# Altium schematic sheet 微机 (2).SchDoc
size A0
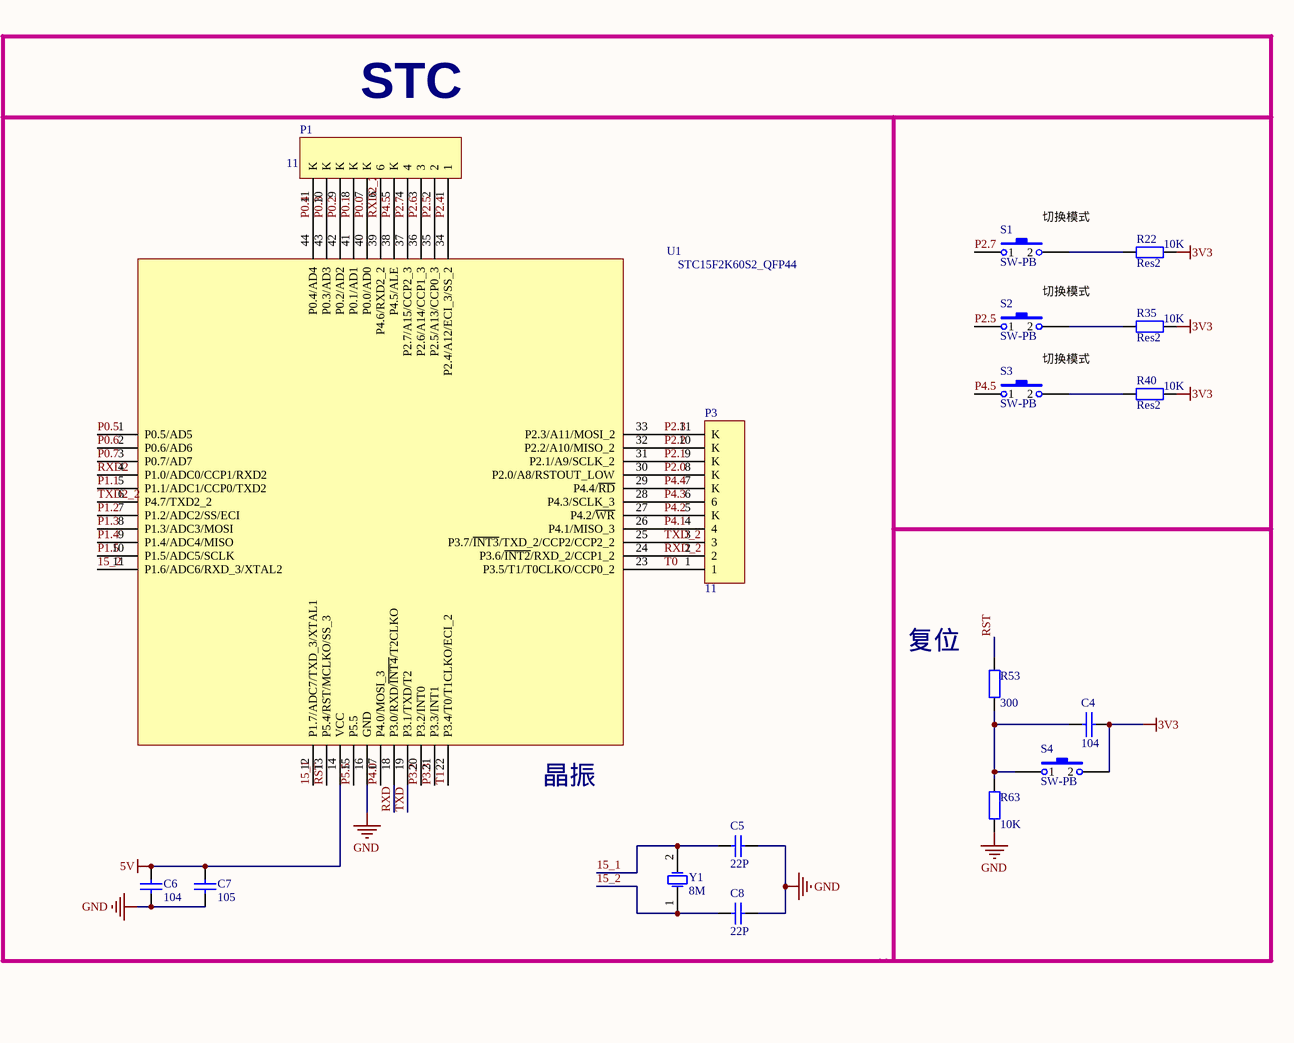
[diagram p0: 微机 (2).SchDoc, top left]
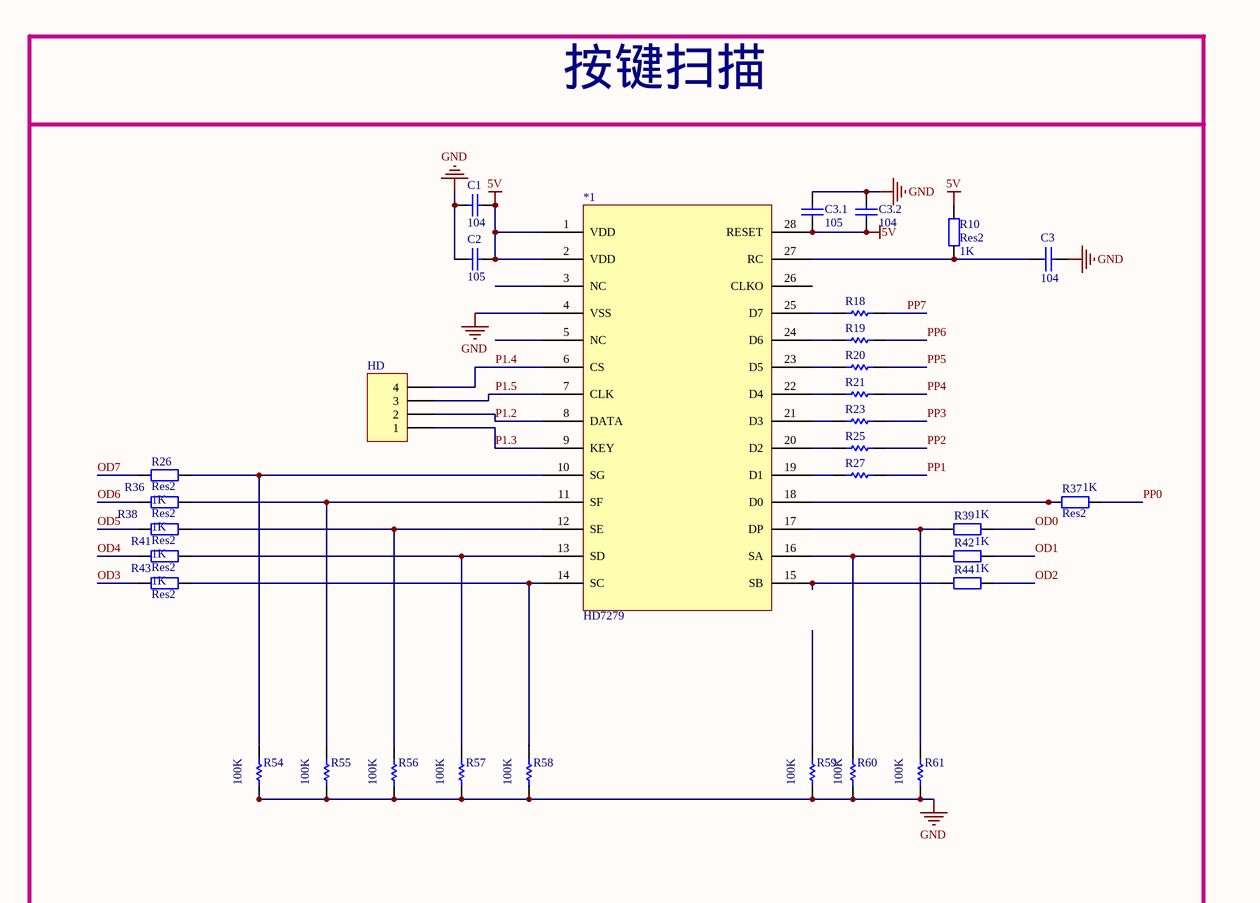
[diagram p1: 微机 (2).SchDoc, top middle]
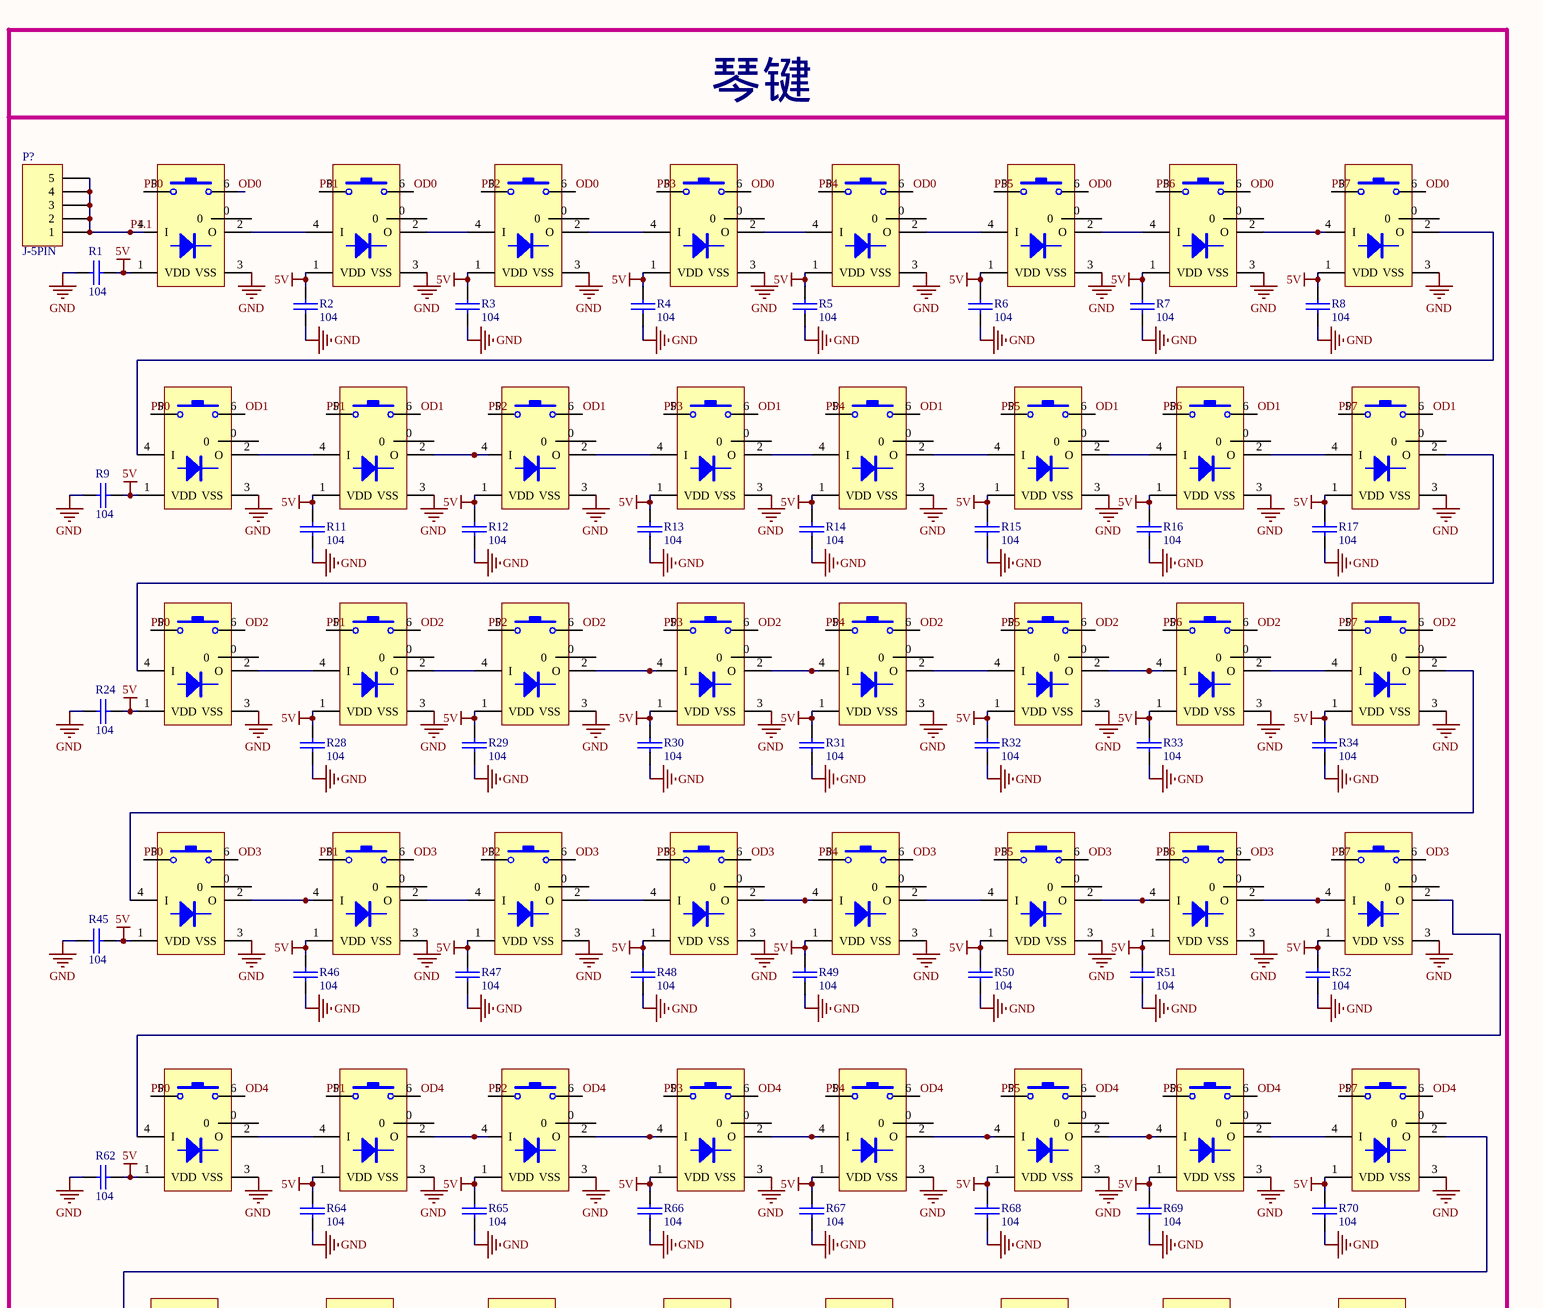
[diagram p2: 微机 (2).SchDoc, top right]
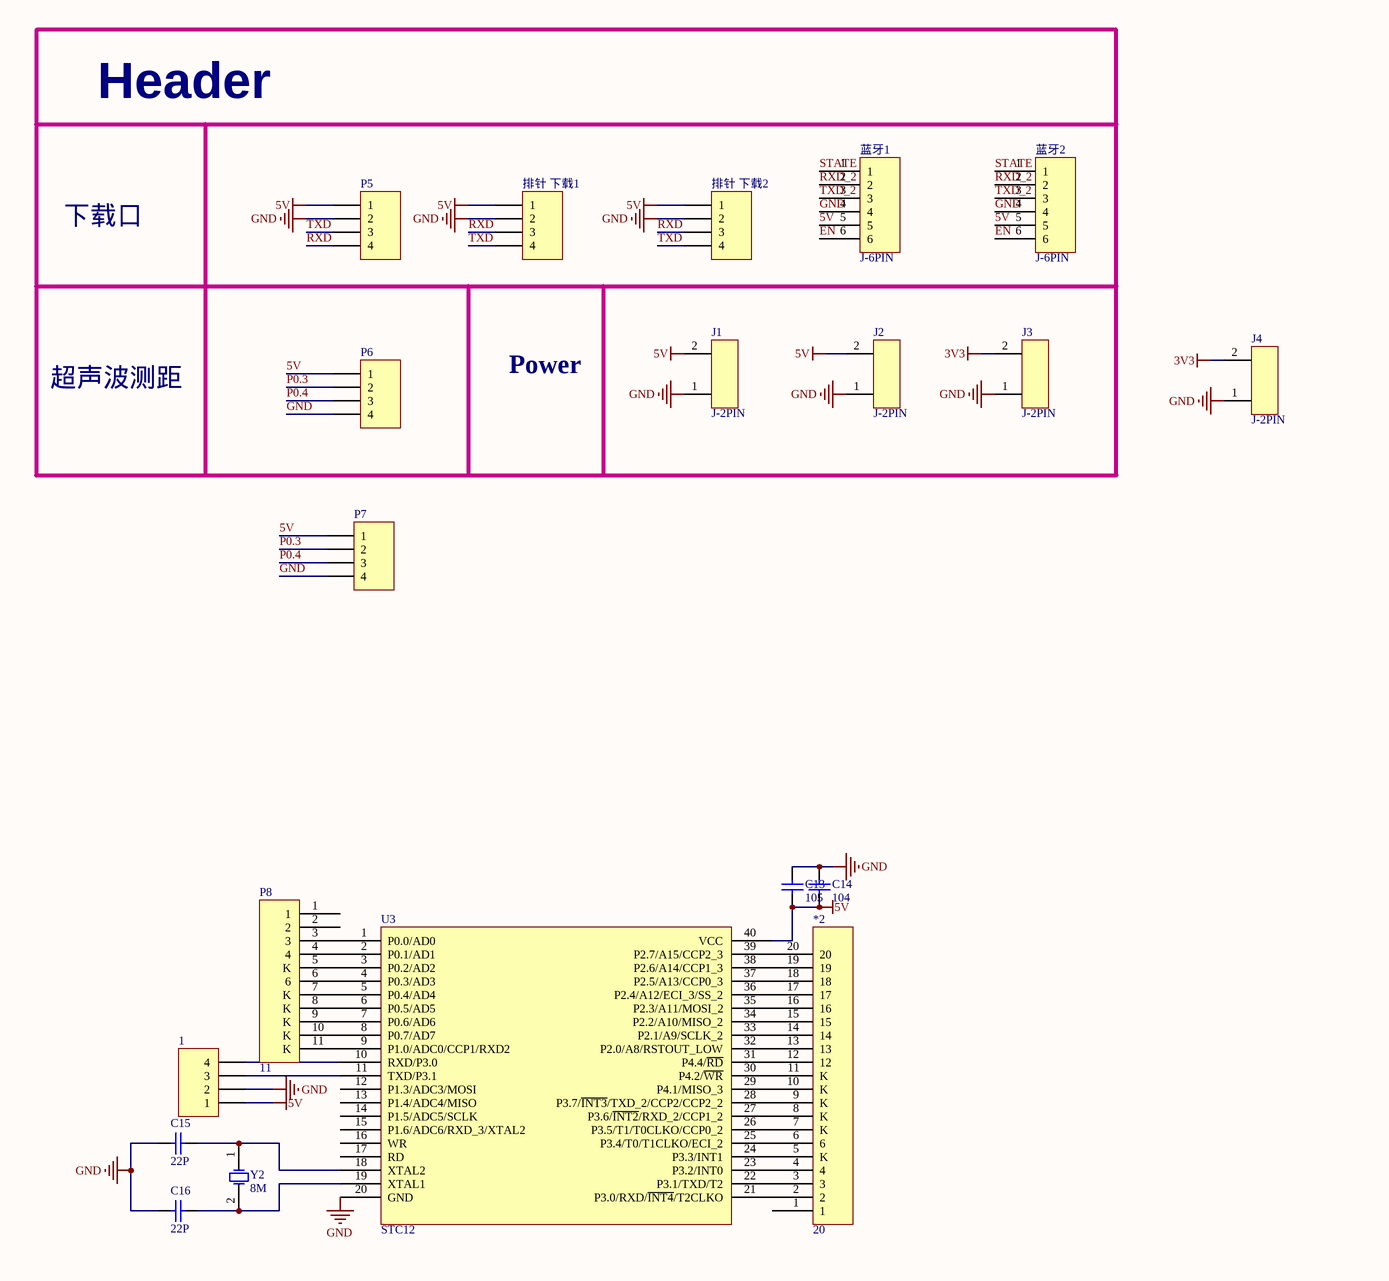
[diagram p3: 微机 (2).SchDoc, bottom left]
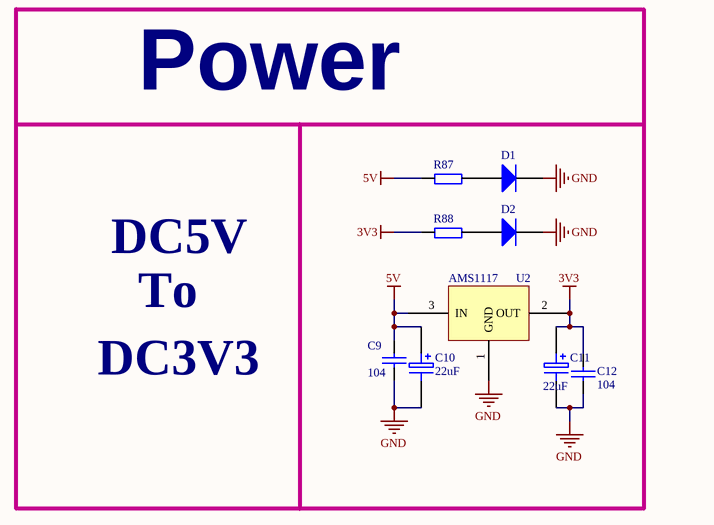
[diagram p4: 微机 (2).SchDoc, bottom middle]
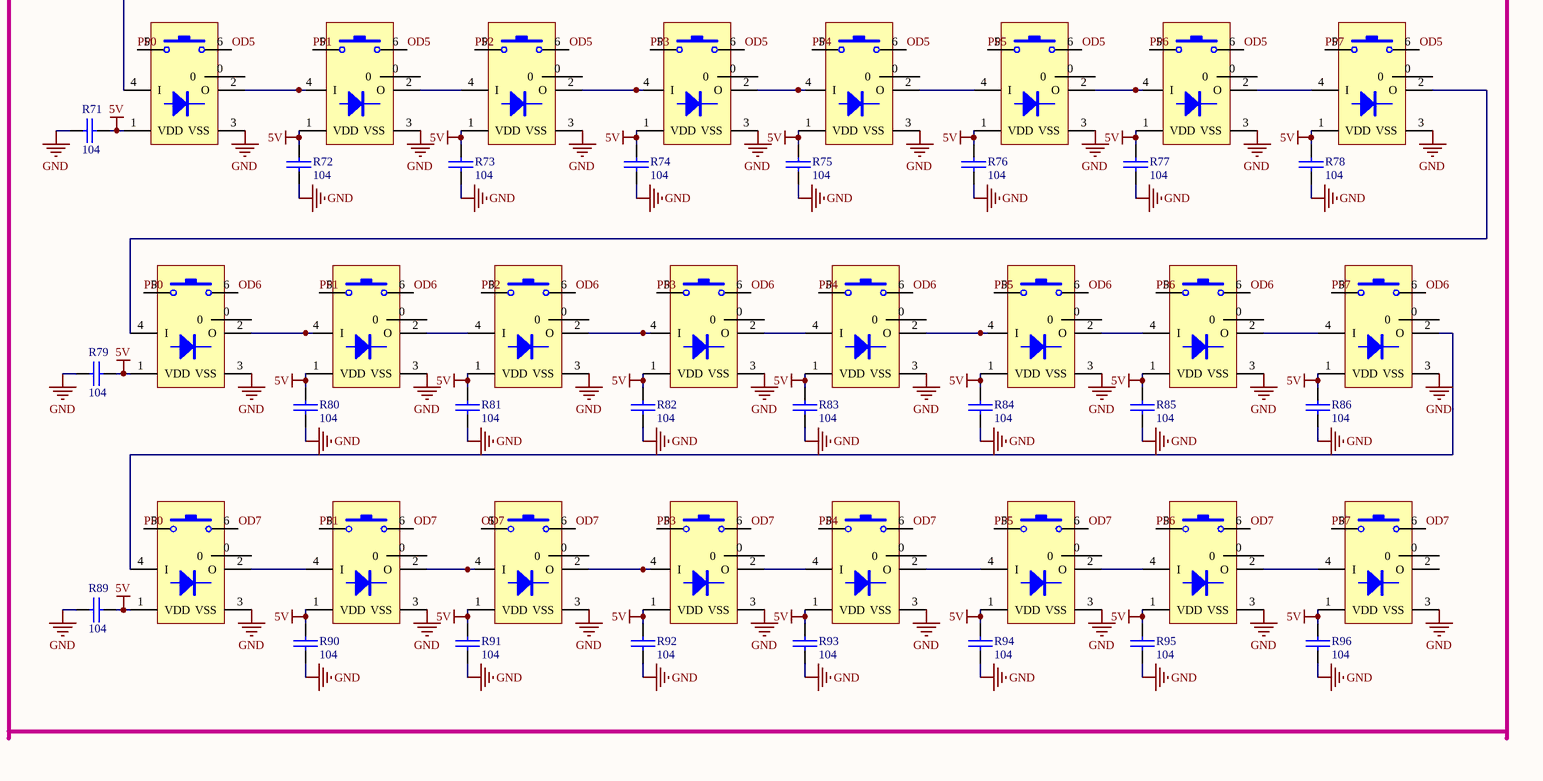
[diagram p5: 微机 (2).SchDoc, bottom right]

## Parts
1  (no value)  [HDR1X4]
*1  HD7279  [sol-28]
*2  20  [HDR1X20]
A1  RGB Light  [按键]  (value not drawn)
A2  RGB Light  [按键]  (value not drawn)
A3  RGB Light  [按键]  (value not drawn)
A4  RGB Light  [按键]  (value not drawn)
A5  RGB Light  [按键]  (value not drawn)
A6  RGB Light  [按键]  (value not drawn)
A7  RGB Light  [按键]  (value not drawn)
A8  RGB Light  [按键]  (value not drawn)
A9  RGB Light  [按键]  (value not drawn)
A10  RGB Light  [按键]  (value not drawn)
A11  RGB Light  [按键]  (value not drawn)
A12  RGB Light  [按键]  (value not drawn)
A13  RGB Light  [按键]  (value not drawn)
A14  RGB Light  [按键]  (value not drawn)
A15  RGB Light  [按键]  (value not drawn)
A16  RGB Light  [按键]  (value not drawn)
A17  RGB Light  [按键]  (value not drawn)
A18  RGB Light  [按键]  (value not drawn)
A19  RGB Light  [按键]  (value not drawn)
A20  RGB Light  [按键]  (value not drawn)
A21  RGB Light  [按键]  (value not drawn)
A22  RGB Light  [按键]  (value not drawn)
A23  RGB Light  [按键]  (value not drawn)
A24  RGB Light  [按键]  (value not drawn)
A25  RGB Light  [按键]  (value not drawn)
A26  RGB Light  [按键]  (value not drawn)
A27  RGB Light  [按键]  (value not drawn)
A28  RGB Light  [按键]  (value not drawn)
A29  RGB Light  [按键]  (value not drawn)
A30  RGB Light  [按键]  (value not drawn)
A31  RGB Light  [按键]  (value not drawn)
A32  RGB Light  [按键]  (value not drawn)
A33  RGB Light  [按键]  (value not drawn)
A34  RGB Light  [按键]  (value not drawn)
A35  RGB Light  [按键]  (value not drawn)
A36  RGB Light  [按键]  (value not drawn)
A37  RGB Light  [按键]  (value not drawn)
A38  RGB Light  [按键]  (value not drawn)
A39  RGB Light  [按键]  (value not drawn)
A40  RGB Light  [按键]  (value not drawn)
A41  RGB Light  [按键]  (value not drawn)
A42  RGB Light  [按键]  (value not drawn)
A43  RGB Light  [按键]  (value not drawn)
A44  RGB Light  [按键]  (value not drawn)
A45  RGB Light  [按键]  (value not drawn)
A46  RGB Light  [按键]  (value not drawn)
A47  RGB Light  [按键]  (value not drawn)
A48  RGB Light  [按键]  (value not drawn)
A49  RGB Light  [按键]  (value not drawn)
A50  RGB Light  [按键]  (value not drawn)
A51  RGB Light  [按键]  (value not drawn)
A52  RGB Light  [按键]  (value not drawn)
A53  RGB Light  [按键]  (value not drawn)
A54  RGB Light  [按键]  (value not drawn)
A55  RGB Light  [按键]  (value not drawn)
A56  RGB Light  [按键]  (value not drawn)
A57  RGB Light  [按键]  (value not drawn)
A58  RGB Light  [按键]  (value not drawn)
A59  RGB Light  [按键]  (value not drawn)
A60  RGB Light  [按键]  (value not drawn)
A61  RGB Light  [按键]  (value not drawn)
A62  RGB Light  [按键]  (value not drawn)
A63  RGB Light  [按键]  (value not drawn)
C1  104  [C-0603C]
C2  105  [C-0603C]
C3  104  [C-0603C]
C3.1  105  [C-0603C]
C3.2  104  [C-0603C]
C4  104  [C-0603C]
C5  22P  [C-0603C]
C6  104  [C-0603C]
C7  105  [C-0603C]
C8  22P  [C-0603C]
C9  104  [C-0603C]
C10  22uF  [CAP-8x12-3.5]
C11  22uF  [CAP-8x12-3.5]
C12  104  [C-0603C]
C13  105  [C-0603C]
C14  104  [C-0603C]
C15  22P  [C-0603C]
C16  22P  [C-0603C]
D1  (no value)  [D-0603D]
D2  (no value)  [D-0603D]
HD  (no value)  [HDR1X4]
J1  J-2PIN  [J-2-2.54-xh]
J2  J-2PIN  [J-2-2.54-xh]
J3  J-2PIN  [J-2-3.81-VH]
J4  J-2PIN  [J-2-3.81-VH]
P1  11  [HDR1X11]
P3  11  [HDR1X11]
P5  (no value)  [USB-Z]
P6  (no value)  [HDR1X4H]
P7  (no value)  [HDR1X4]
P8  11  [HDR1X11]
P?  J-5PIN  [HDR1X5]
R1  104  [C-0603C]
R2  104  [C-0603C]
R3  104  [C-0603C]
R4  104  [C-0603C]
R5  104  [C-0603C]
R6  104  [C-0603C]
R7  104  [C-0603C]
R8  104  [C-0603C]
R9  104  [C-0603C]
R10  Res2  value 1K  [R-0603R]
R11  104  [C-0603C]
R12  104  [C-0603C]
R13  104  [C-0603C]
R14  104  [C-0603C]
R15  104  [C-0603C]
R16  104  [C-0603C]
R17  104  [C-0603C]
R18  (no value)  [R-0603R]
R19  (no value)  [R-0603R]
R20  (no value)  [R-0603R]
R21  (no value)  [R-0603R]
R22  Res2  value 10K  [R-0603R]
R23  (no value)  [R-0603R]
R24  104  [C-0603C]
R25  (no value)  [R-0603R]
R26  Res2  value 1K  [R-0603R]
R27  (no value)  [R-0603R]
R28  104  [C-0603C]
R29  104  [C-0603C]
R30  104  [C-0603C]
R31  104  [C-0603C]
R32  104  [C-0603C]
R33  104  [C-0603C]
R34  104  [C-0603C]
R35  Res2  value 10K  [R-0603R]
R36  Res2  value 1K  [R-0603R]
R37  Res2  value 1K  [R-0603R]
R38  Res2  value 1K  [R-0603R]
R39  value 1K  [R-0603R]  (hidden comment: Res2)
R40  Res2  value 10K  [R-0603R]
R41  Res2  value 1K  [R-0603R]
R42  value 1K  [R-0603R]  (hidden comment: Res2)
R43  Res2  [R-0603R]
R44  value 1K  [R-0603R]  (hidden comment: Res2)
R45  104  [C-0603C]
R46  104  [C-0603C]
R47  104  [C-0603C]
R48  104  [C-0603C]
R49  104  [C-0603C]
R50  104  [C-0603C]
R51  104  [C-0603C]
R52  104  [C-0603C]
R53  value 300  [R-0603R]  (hidden comment: Res2)
R54  100K  [R-0603R]
R55  100K  [R-0603R]
R56  100K  [R-0603R]
R57  100K  [R-0603R]
R58  100K  [R-0603R]
R59  100K  [R-0603R]
R60  100K  [R-0603R]
R61  100K  [R-0603R]
R62  104  [C-0603C]
R63  value 10K  [R-0603R]  (hidden comment: Res2)
R64  104  [C-0603C]
R65  104  [C-0603C]
R66  104  [C-0603C]
R67  104  [C-0603C]
R68  104  [C-0603C]
R69  104  [C-0603C]
R70  104  [C-0603C]
R71  104  [C-0603C]
R72  104  [C-0603C]
R73  104  [C-0603C]
R74  104  [C-0603C]
R75  104  [C-0603C]
R76  104  [C-0603C]
R77  104  [C-0603C]
R78  104  [C-0603C]
R79  104  [C-0603C]
R80  104  [C-0603C]
R81  104  [C-0603C]
R82  104  [C-0603C]
R83  104  [C-0603C]
R84  104  [C-0603C]
R85  104  [C-0603C]
R86  104  [C-0603C]
R87  10K  [R-0603R]  (value not drawn)
R88  10K  [R-0603R]  (value not drawn)
R89  104  [C-0603C]
R90  104  [C-0603C]
R91  104  [C-0603C]
R92  104  [C-0603C]
R93  104  [C-0603C]
R94  104  [C-0603C]
R95  104  [C-0603C]
R96  104  [C-0603C]
S1  SW-PB  [模式转换开关]
S2  SW-PB  [模式转换开关]
S3  SW-PB  [模式转换开关]
S4  SW-PB  [模式转换开关]
U1  STC15F2K60S2_QFP44  [LQFP44]
U2  AMS1117  [SOT-223]
U3  STC12  [DIP40]
Y1  8M  [X-HC49SM]
Y2  8M  [X-HC49SM]
按1  RGB Light  [按键]  (value not drawn)
排针_下载1  (no value)  [HDR1X4]
排针_下载2  (no value)  [HDR1X4]
蓝牙1  J-6PIN  [HDR1X6]
蓝牙2  J-6PIN  [HDR1X6H]

## Blocks framed on the sheet
按键扫描: *1 C1-C3 C3.1 C3.2 HD R10 R18-R21 R23 R25-R27 R36-R39 R41-R44 R54-R61
Power: C9-C12 D1 D2 R87 R88 U2

## Nets
3V3: C4.2 C11.1 C12.1 J3.2 J4.2 R22.2 R35.2 R40.2 R88.1 S4.2 U2.2(OUT)
5V: 1.1 *1.1(VDD) *1.2(VDD) *1.28(RESET) A1.1(VDD) A2.1(VDD) A3.1(VDD) A4.1(VDD) A5.1(VDD) A6.1(VDD) A7.1(VDD) A8.1(VDD) A9.1(VDD) A10.1(VDD) A11.1(VDD) A12.1(VDD) A13.1(VDD) A14.1(VDD) A15.1(VDD) A16.1(VDD) A17.1(VDD) A18.1(VDD) A19.1(VDD) A20.1(VDD) A21.1(VDD) A22.1(VDD) A23.1(VDD) A24.1(VDD) A25.1(VDD) A26.1(VDD) A27.1(VDD) A28.1(VDD) A29.1(VDD) A30.1(VDD) A31.1(VDD) A32.1(VDD) A33.1(VDD) A34.1(VDD) A35.1(VDD) A36.1(VDD) A37.1(VDD) A38.1(VDD) A39.1(VDD) A40.1(VDD) A41.1(VDD) A42.1(VDD) A43.1(VDD) A44.1(VDD) A45.1(VDD) A46.1(VDD) A47.1(VDD) A48.1(VDD) A49.1(VDD) A50.1(VDD) A51.1(VDD) A52.1(VDD) A53.1(VDD) A54.1(VDD) A55.1(VDD) A56.1(VDD) A57.1(VDD) A58.1(VDD) A59.1(VDD) A60.1(VDD) A61.1(VDD) A62.1(VDD) A63.1(VDD) C1.1 C2.1 C3.1.1 C3.2.1 C6.1 C7.1 C9.1 C10.1 C13.1 C14.1 J1.2 J2.2 P5.1 P6.1 P7.1 R1.2 R2.2 R3.2 R4.2 R5.2 R6.2 R7.2 R8.2 R9.2 R10.2 R11.2 R12.2 R13.2 R14.2 R15.2 R16.2 R17.2 R24.2 R28.2 R29.2 R30.2 R31.2 R32.2 R33.2 R34.2 R45.2 R46.2 R47.2 R48.2 R49.2 R50.2 R51.2 R52.2 R62.2 R64.2 R65.2 R66.2 R67.2 R68.2 R69.2 R70.2 R71.2 R72.2 R73.2 R74.2 R75.2 R76.2 R77.2 R78.2 R79.2 R80.2 R81.2 R82.2 R83.2 R84.2 R85.2 R86.2 R87.1 R89.2 R90.2 R91.2 R92.2 R93.2 R94.2 R95.2 R96.2 U1.14(VCC) U2.3(IN) U3.40(VCC) 按1.1(VDD) 排针_下载1.1 排针_下载2.1 蓝牙1.5 蓝牙2.5
GND: 1.2 *1.4(VSS) A1.3(VSS) A2.3(VSS) A3.3(VSS) A4.3(VSS) A5.3(VSS) A6.3(VSS) A7.3(VSS) A8.3(VSS) A9.3(VSS) A10.3(VSS) A11.3(VSS) A12.3(VSS) A13.3(VSS) A14.3(VSS) A15.3(VSS) A16.3(VSS) A17.3(VSS) A18.3(VSS) A19.3(VSS) A20.3(VSS) A21.3(VSS) A22.3(VSS) A23.3(VSS) A24.3(VSS) A25.3(VSS) A26.3(VSS) A27.3(VSS) A28.3(VSS) A29.3(VSS) A30.3(VSS) A31.3(VSS) A32.3(VSS) A33.3(VSS) A34.3(VSS) A35.3(VSS) A36.3(VSS) A37.3(VSS) A38.3(VSS) A39.3(VSS) A40.3(VSS) A41.3(VSS) A42.3(VSS) A43.3(VSS) A44.3(VSS) A45.3(VSS) A46.3(VSS) A47.3(VSS) A48.3(VSS) A49.3(VSS) A50.3(VSS) A51.3(VSS) A52.3(VSS) A53.3(VSS) A54.3(VSS) A55.3(VSS) A56.3(VSS) A57.3(VSS) A58.3(VSS) A59.3(VSS) A60.3(VSS) A61.3(VSS) A62.3(VSS) A63.3(VSS) C1.2 C2.2 C3.2 C3.1.2 C3.2.2 C5.2 C6.2 C7.2 C8.2 C9.2 C10.2 C11.2 C12.2 C13.2 C14.2 C15.2 C16.2 D1.2(K) D2.2(K) J1.1 J2.1 J3.1 J4.1 P5.2 P6.4 P7.4 R1.1 R2.1 R3.1 R4.1 R5.1 R6.1 R7.1 R8.1 R9.1 R11.1 R12.1 R13.1 R14.1 R15.1 R16.1 R17.1 R24.1 R28.1 R29.1 R30.1 R31.1 R32.1 R33.1 R34.1 R45.1 R46.1 R47.1 R48.1 R49.1 R50.1 R51.1 R52.1 R54.1 R55.1 R56.1 R57.1 R58.1 R59.1 R60.1 R61.1 R62.1 R63.1 R64.1 R65.1 R66.1 R67.1 R68.1 R69.1 R70.1 R71.1 R72.1 R73.1 R74.1 R75.1 R76.1 R77.1 R78.1 R79.1 R80.1 R81.1 R82.1 R83.1 R84.1 R85.1 R86.1 R89.1 R90.1 R91.1 R92.1 R93.1 R94.1 R95.1 R96.1 U1.16(GND) U2.1(GND) U3.20(GND) 按1.3(VSS) 排针_下载1.2 排针_下载2.2 蓝牙1.4 蓝牙2.4
15_1: C5.1 U1.12(P1.7/ADC7/TXD_3/XTAL1) Y1.2(OSC2)
15_2: C8.1 U1.11(P1.6/ADC6/RXD_3/XTAL2) Y1.1(OSC1)
EN: 蓝牙1.6 蓝牙2.6
OD0: A1.6 A2.6 A3.6 A4.6 A5.6 A6.6 A7.6 R39.1 按1.6
OD1: A8.6 A9.6 A10.6 A11.6 A12.6 A13.6 A14.6 A15.6 R42.1
OD2: A16.6 A17.6 A18.6 A19.6 A20.6 A21.6 A22.6 A23.6 R44.1
OD3: A24.6 A25.6 A26.6 A27.6 A28.6 A29.6 A30.6 A31.6 R43.1
OD4: A32.6 A33.6 A34.6 A35.6 A36.6 A37.6 A38.6 A39.6 R41.1
OD5: A40.6 A41.6 A42.6 A43.6 A44.6 A45.6 A46.6 A47.6 R38.1
OD6: A48.6 A49.6 A50.6 A51.6 A52.6 A53.6 A54.6 A55.6 R36.1
OD7: A56.6 A57.6 A58.5 A58.6 A59.6 A60.6 A61.6 A62.6 A63.6 R26.1
P0.0: P1.7(K) U1.40(P0.0/AD0)
P0.1: P1.8(K) U1.41(P0.1/AD1)
P0.2: P1.9(K) U1.42(P0.2/AD2)
P0.3: P1.10(K) P6.2 P7.2 U1.43(P0.3/AD3)
P0.4: P1.11(K) P6.3 P7.3 U1.44(P0.4/AD4)
P0.5: U1.1(P0.5/AD5)
P0.6: U1.2(P0.6/AD6)
P0.7: U1.3(P0.7/AD7)
P1.1: A1.4(I) P?.1 P?.2 P?.3 P?.4 P?.5 U1.5(P1.1/ADC1/CCP0/TXD2)
P1.2: *1.8(DATA) HD.2 U1.7(P1.2/ADC2/SS/ECI)
P1.3: *1.9(KEY) HD.1 U1.8(P1.3/ADC3/MOSI)
P1.4: *1.6(CS) HD.4 U1.9(P1.4/ADC4/MISO)
P1.5: *1.7(CLK) HD.3 U1.10(P1.5/ADC5/SCLK)
P2.0: P3.8(K) U1.30(P2.0/A8/RSTOUT_LOW)
P2.1: P3.9(K) U1.31(P2.1/A9/SCLK_2)
P2.2: P3.10(K) U1.32(P2.2/A10/MISO_2)
P2.3: P3.11(K) U1.33(P2.3/A11/MOSI_2)
P2.4: P1.1 U1.34(P2.4/A12/ECI_3/SS_2)
P2.5: P1.2 S2.1 U1.35(P2.5/A13/CCP0_3)
P2.6: P1.3 U1.36(P2.6/A14/CCP1_3)
P2.7: P1.4 S1.1 U1.37(P2.7/A15/CCP2_3)
P3.2: U1.20(P3.2/INT0)
P3.3: U1.21(P3.3/INT1)
P4.0: U1.17(P4.0/MOSI_3)
P4.1: P3.4 U1.26(P4.1/MISO_3)
P4.2: P3.5(K) U1.27(P4.2/~{WR})
P4.3: P3.6 U1.28(P4.3/SCLK_3)
P4.4: P3.7(K) U1.29(P4.4/~{RD})
P4.5: P1.5(K) S3.1 U1.38(P4.5/ALE)
P5.5: U1.15(P5.5)
PP0: A1.5 A8.5 A16.5 A24.5 A32.5 A40.5 A48.5 A56.5 R37.1
PP1: A2.5 A9.5 A17.5 A25.5 A33.5 A41.5 A49.5 A57.5 R27.1
PP2: A3.5 A10.5 A18.5 A26.5 A34.5 A42.5 A50.5 R25.1
PP3: A4.5 A11.5 A19.5 A27.5 A35.5 A43.5 A51.5 A59.5 R23.1
PP4: A5.5 A12.5 A20.5 A28.5 A36.5 A44.5 A52.5 A60.5 R21.1
PP5: A6.5 A13.5 A21.5 A29.5 A37.5 A45.5 A53.5 A61.5 R20.1
PP6: A7.5 A14.5 A22.5 A30.5 A38.5 A46.5 A54.5 A62.5 R19.1
PP7: A15.5 A23.5 A31.5 A39.5 A47.5 A55.5 A63.5 R18.1 按1.5
RST: R53.2 U1.13(P5.4/RST/MCLKO/SS_3)
RXD: P5.4 U1.18(P3.0/RXD/~{INT4}/T2CLKO) 排针_下载1.3 排针_下载2.3
RXD2: U1.4(P1.0/ADC0/CCP1/RXD2)
RXD2_2: P1.6 U1.39(P4.6/RXD2_2)
RXD_2: P3.2 U1.24(P3.6/~{INT2}/RXD_2/CCP1_2) 蓝牙1.2 蓝牙2.2
STATE: 蓝牙1.1 蓝牙2.1
T0: P3.1 U1.23(P3.5/T1/T0CLKO/CCP0_2)
T1: U1.22(P3.4/T0/T1CLKO/ECI_2)
TXD: P5.3 U1.19(P3.1/TXD/T2) 排针_下载1.4 排针_下载2.4
TXD2_2: U1.6(P4.7/TXD2_2)
TXD_2: P3.3 U1.25(P3.7/~{INT3}/TXD_2/CCP2/CCP2_2) 蓝牙1.3 蓝牙2.3
Net1_3: 1.3 U3.11(TXD/P3.1)
Net1_4: 1.4 U3.10(RXD/P3.0)
Net*1_10: *1.10(SG) R26.2 R54.2
Net*1_11: *1.11(SF) R36.2 R55.2
Net*1_12: *1.12(SE) R38.2 R56.2
Net*1_13: *1.13(SD) R41.2 R57.2
Net*1_14: *1.14(SC) R43.2 R58.2
Net*1_15: *1.15(SB) R44.2
Net*1_16: *1.16(SA) R42.2 R60.2
Net*1_17: *1.17(DP) R39.2 R61.2
Net*1_18: *1.18(D0) R37.2
Net*1_19: *1.19(D1) R27.2
Net*1_20: *1.20(D2) R25.2
Net*1_21: *1.21(D3) R23.2
Net*1_22: *1.22(D4) R21.2
Net*1_23: *1.23(D5) R20.2
Net*1_24: *1.24(D6) R19.2
Net*1_25: *1.25(D7) R18.2
Net*1_27: *1.27(RC) C3.1 R10.1
Net*2_2: *2.2 U3.21(P3.0/RXD/~{INT4}/T2CLKO)
Net*2_3: *2.3 U3.22(P3.1/TXD/T2)
Net*2_4: *2.4 U3.23(P3.2/INT0)
Net*2_5: *2.5(K) U3.24(P3.3/INT1)
Net*2_6: *2.6 U3.25(P3.4/T0/T1CLKO/ECI_2)
Net*2_7: *2.7(K) U3.26(P3.5/T1/T0CLKO/CCP0_2)
Net*2_8: *2.8(K) U3.27(P3.6/~{INT2}/RXD_2/CCP1_2)
Net*2_9: *2.9(K) U3.28(P3.7/~{INT3}/TXD_2/CCP2/CCP2_2)
Net*2_10: *2.10(K) U3.29(P4.1/MISO_3)
Net*2_11: *2.11(K) U3.30(P4.2/~{WR})
Net*2_12: *2.12 U3.31(P4.4/~{RD})
Net*2_13: *2.13 U3.32(P2.0/A8/RSTOUT_LOW)
Net*2_14: *2.14 U3.33(P2.1/A9/SCLK_2)
Net*2_15: *2.15 U3.34(P2.2/A10/MISO_2)
Net*2_16: *2.16 U3.35(P2.3/A11/MOSI_2)
Net*2_17: *2.17 U3.36(P2.4/A12/ECI_3/SS_2)
Net*2_18: *2.18 U3.37(P2.5/A13/CCP0_3)
Net*2_19: *2.19 U3.38(P2.6/A14/CCP1_3)
Net*2_20: *2.20 U3.39(P2.7/A15/CCP2_3)
NetA1_2: A1.2(O) A2.4(I)
NetA2_2: A2.2(O) A3.4(I)
NetA3_2: A3.2(O) A4.4(I)
NetA4_2: A4.2(O) A5.4(I)
NetA5_2: A5.2(O) A6.4(I)
NetA6_2: A6.2(O) A7.4(I)
NetA7_2: A7.2(O) 按1.4(I)
NetA8_2: A8.2(O) A9.4(I)
NetA8_4: A8.4(I) 按1.2(O)
NetA9_2: A9.2(O) A10.4(I)
NetA10_2: A10.2(O) A11.4(I)
NetA11_2: A11.2(O) A12.4(I)
NetA12_2: A12.2(O) A13.4(I)
NetA13_2: A13.2(O) A14.4(I)
NetA14_2: A14.2(O) A15.4(I)
NetA15_2: A15.2(O) A16.4(I)
NetA16_2: A16.2(O) A17.4(I)
NetA17_2: A17.2(O) A18.4(I)
NetA18_2: A18.2(O) A19.4(I)
NetA19_2: A19.2(O) A20.4(I)
NetA20_2: A20.2(O) A21.4(I)
NetA21_2: A21.2(O) A22.4(I)
NetA22_2: A22.2(O) A23.4(I)
NetA23_2: A23.2(O) A24.4(I)
NetA24_2: A24.2(O) A25.4(I)
NetA25_2: A25.2(O) A26.4(I)
NetA26_2: A26.2(O) A27.4(I)
NetA27_2: A27.2(O) A28.4(I)
NetA28_2: A28.2(O) A29.4(I)
NetA29_2: A29.2(O) A30.4(I)
NetA30_2: A30.2(O) A31.4(I)
NetA31_2: A31.2(O) A32.4(I)
NetA32_2: A32.2(O) A33.4(I)
NetA33_2: A33.2(O) A34.4(I)
NetA34_2: A34.2(O) A35.4(I)
NetA35_2: A35.2(O) A36.4(I)
NetA36_2: A36.2(O) A37.4(I)
NetA37_2: A37.2(O) A38.4(I)
NetA38_2: A38.2(O) A39.4(I)
NetA39_2: A39.2(O) A40.4(I)
NetA40_2: A40.2(O) A41.4(I)
NetA41_2: A41.2(O) A42.4(I)
NetA42_2: A42.2(O) A43.4(I)
NetA43_2: A43.2(O) A44.4(I)
NetA44_2: A44.2(O) A45.4(I)
NetA45_2: A45.2(O) A46.4(I)
NetA46_2: A46.2(O) A47.4(I)
NetA47_2: A47.2(O) A48.4(I)
NetA48_2: A48.2(O) A49.4(I)
NetA49_2: A49.2(O) A50.4(I)
NetA50_2: A50.2(O) A51.4(I)
NetA51_2: A51.2(O) A52.4(I)
NetA52_2: A52.2(O) A53.4(I)
NetA53_2: A53.2(O) A54.4(I)
NetA54_2: A54.2(O) A55.4(I)
NetA55_2: A55.2(O) A56.4(I)
NetA56_2: A56.2(O) A57.4(I)
NetA57_2: A57.2(O) A58.4(I)
NetA58_2: A58.2(O) A59.4(I)
NetA59_2: A59.2(O) A60.4(I)
NetA60_2: A60.2(O) A61.4(I)
NetA61_2: A61.2(O) A62.4(I)
NetA62_2: A62.2(O) A63.4(I)
NetC4_1: C4.1 R53.1 R63.2 S4.1
NetC15_1: C15.1 U3.18(XTAL2) Y2.1(OSC1)
NetC16_1: C16.1 U3.19(XTAL1) Y2.2(OSC2)
NetD1_1: D1.1(A) R87.2
NetD2_1: D2.1(A) R88.2
NetP8_3: P8.3 U3.1(P0.0/AD0)
NetP8_4: P8.4 U3.2(P0.1/AD1)
NetP8_5: P8.5(K) U3.3(P0.2/AD2)
NetP8_6: P8.6 U3.4(P0.3/AD3)
NetP8_7: P8.7(K) U3.5(P0.4/AD4)
NetP8_8: P8.8(K) U3.6(P0.5/AD5)
NetP8_9: P8.9(K) U3.7(P0.6/AD6)
NetP8_10: P8.10(K) U3.8(P0.7/AD7)
NetP8_11: P8.11(K) U3.9(P1.0/ADC0/CCP1/RXD2)
NetR22_1: R22.1 S1.2
NetR35_1: R35.1 S2.2
NetR40_1: R40.1 S3.2

Not connected (* = marked no-connect by the designer): *1 3(NC) 5(NC) 26(CLKO); *2 1; A1 0; A2 0; A3 0; A4 0; A5 0; A6 0; A7 0; A8 0; A9 0; A10 0; A11 0; A12 0; A13 0; A14 0; A15 0; A16 0; A17 0; A18 0; A19 0; A20 0; A21 0; A22 0; A23 0; A24 0; A25 0; A26 0; A27 0; A28 0; A29 0; A30 0; A31 0; A32 0; A33 0; A34 0; A35 0; A36 0; A37 0; A38 0; A39 0; A40 0; A41 0; A42 0; A43 0; A44 0; A45 0; A46 0; A47 0; A48 0; A49 0; A50 0; A51 0; A52 0; A53 0; A54 0; A55 0; A56 0; A57 0; A58 0; A59 0; A60 0; A61 0; A62 0; A63 0 2(O); P8 1 2; R59 2; U3 12(P1.3/ADC3/MOSI) 13(P1.4/ADC4/MISO) 14(P1.5/ADC5/SCLK) 15(P1.6/ADC6/RXD_3/XTAL2) 16(WR) 17(RD); 按1 0

## Notes on the sheet
- STC
- 琴键
- (near S1) 切换模式
- 切换模式
- 复位
- (near U1) 晶振
- Header
- 下载口
- DC5V
- 超声波测距
- Power
- To
- DC3V3

## Library data of the parts
1 HD P5 排针_下载1 排针_下载2 = Header 4: Header, 4-Pin; LatestRevisionDate: 17-Jul-2002; LatestRevisionNote: Re-released for DXP Platform.; Publisher: Altium Limited
*1 = HD7292
C1 C2 C3.1 C3.2 C5-C8 C13-C16 = Cap: Capacitor; Value: 100pF; Published: 8-Jun-2000; LatestRevisionDate: 17-Jul-2002; LatestRevisionNote: Re-released for DXP Platform.; PackageReference: RAD-0.3; Publisher: Altium Limited
C3 C4 R1-R9 R11-R17 R24 R28-R34 R45-R52 R62 R64-R86 R89-R96 = C-贴片电容: Capacitor
C9 C12 = CAP: Capacitor
C10 C11 = ELECTRO1: Electrolytic Capacitor
D1 D2 = D-发光二极管: Default Diode; Published: 8-Jun-2000; LatestRevisionDate: 17-Jul-2002; LatestRevisionNote: Re-released for DXP Platform.; PackageDocument: Sep-1996; PackageReference: SMC; Publisher: Altium Limited; Code_JEDEC: DO-214-AB
J1-J4 = J-2PIN: SOCKET
P6 P7 = J-4PIN: Header, 4-Pin; LatestRevisionDate: 17-Jul-2002; LatestRevisionNote: Re-released for DXP Platform.; Publisher: Altium Limited
P? = J-5PIN: Header, 5-Pin; LatestRevisionDate: 17-Jul-2002; LatestRevisionNote: Re-released for DXP Platform.; Publisher: Altium Limited
R10 R22 R26 R35-R44 R53 R63 = Res2: Resistor; Published: 8-Jun-2000; LatestRevisionDate: 17-Jul-2002; LatestRevisionNote: Re-released for DXP Platform.; PackageReference: AXIAL-0.4; Publisher: Altium Limited
R18-R21 R23 R25 R27 R54-R61 = Resistor-1: Resistor; Published: 8-Jun-2000; LatestRevisionDate: 17-Jul-2002; LatestRevisionNote: Re-released for DXP Platform.; PackageReference: AXIAL-0.3; Publisher: Altium Limited; PackageDescription: Axial Device, Thru-Hole; 2 Leads; 0.3 in Pin Spacing
R87 R88 = Resistor: RES, 10K, 5%, 0.1 W, 0603
S1-S4 = SW-PB: Switch; Published: 24-Mar-1999; LatestRevisionDate: 17-Jul-2002; LatestRevisionNote: Re-released for DXP Platform.; PackageReference: SPST-2; Publisher: Altium Limited
U2 = Component_1
Y1 Y2 = XTAL: Crystal Oscillator; Published: 8-Jun-2000; LatestRevisionDate: 17-Jul-2002; LatestRevisionNote: Re-released for DXP Platform.; PackageReference: R38; Publisher: Altium Limited
A1-A63 按1 = RGB Light: RGB Light: RGB Light